# EAGLE design shield (EAGLE 9.0.1)
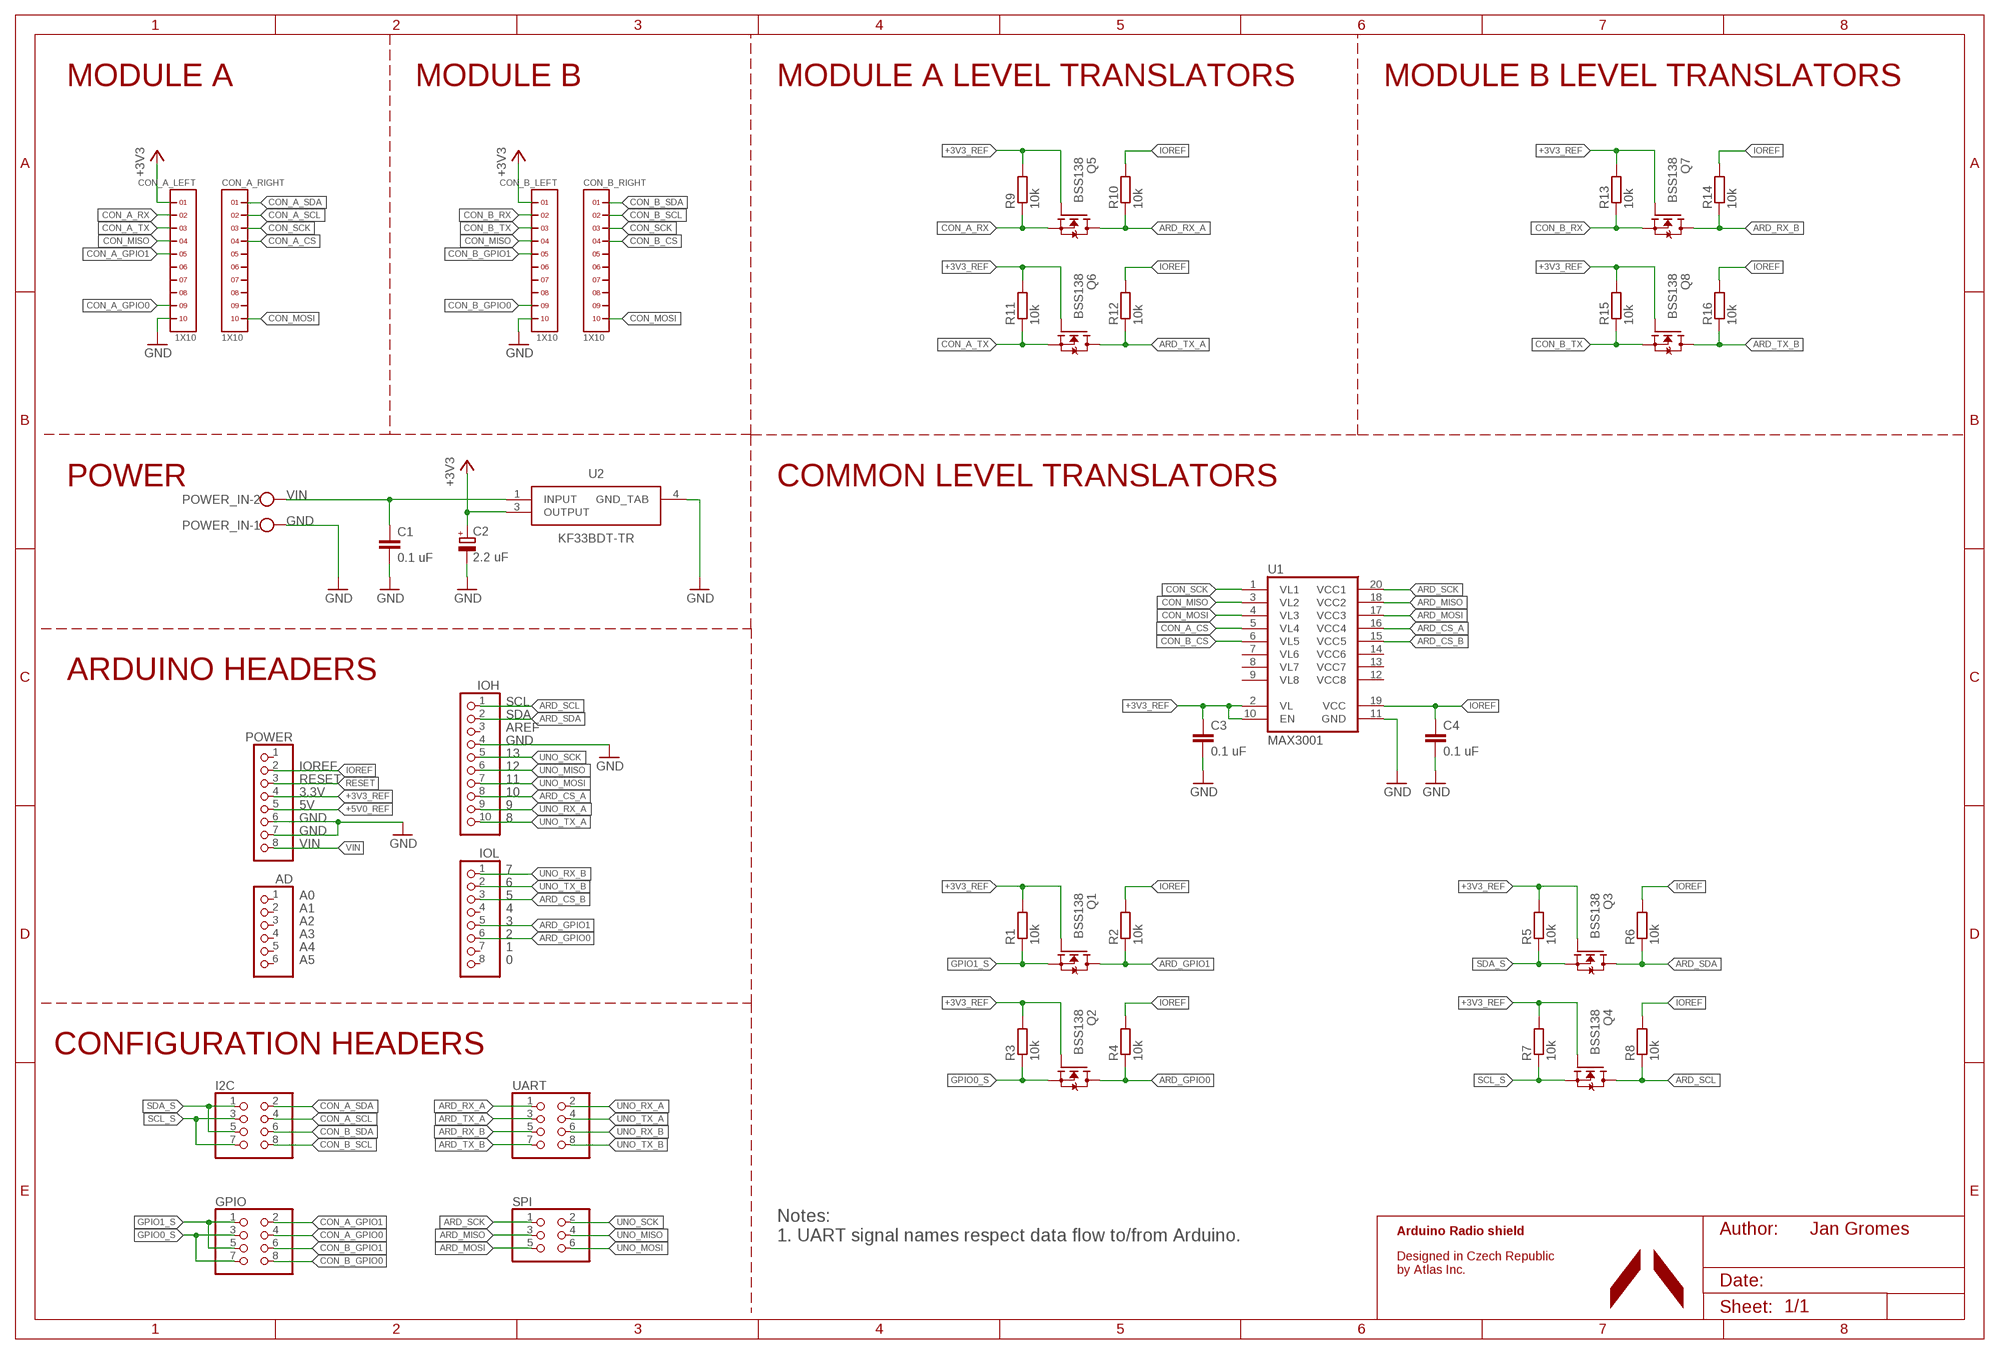
[diagram p0: schematic, sheet 1]

## Parts
AD  PINHD-1X6  [1X06]
C1  0.1 uF  C-EUC0603  [C0603]
C2  2.2 uF  CPOL-EUSMCA  [SMC_A]
C3  0.1 uF  C-EUC0603  [C0603]
C4  0.1 uF  C-EUC0603  [C0603]
CON_A_LEFT  1X10  [1X10]
CON_A_RIGHT  1X10  [1X10]
CON_B_LEFT  1X10  [1X10]
CON_B_RIGHT  1X10  [1X10]
GPIO  PINHD-2X4  [2X04]
I2C  PINHD-2X4  [2X04]
IOH  PINHD-1X10  [1X10]
IOL  PINHD-1X8  [1X08]
POWER  PINHD-1X8  [1X08]
POWER_IN  W237-102  [W237-102]
Q1  BSS138  [SOT23]
Q2  BSS138  [SOT23]
Q3  BSS138  [SOT23]
Q4  BSS138  [SOT23]
Q5  BSS138  [SOT23]
Q6  BSS138  [SOT23]
Q7  BSS138  [SOT23]
Q8  BSS138  [SOT23]
R1  10k  R-EU_R0603  [R0603]
R2  10k  R-EU_R0603  [R0603]
R3  10k  R-EU_R0603  [R0603]
R4  10k  R-EU_R0603  [R0603]
R5  10k  R-EU_R0603  [R0603]
R6  10k  R-EU_R0603  [R0603]
R7  10k  R-EU_R0603  [R0603]
R8  10k  R-EU_R0603  [R0603]
R9  10k  R-EU_R0603  [R0603]
R10  10k  R-EU_R0603  [R0603]
R11  10k  R-EU_R0603  [R0603]
R12  10k  R-EU_R0603  [R0603]
R13  10k  R-EU_R0603  [R0603]
R14  10k  R-EU_R0603  [R0603]
R15  10k  R-EU_R0603  [R0603]
R16  10k  R-EU_R0603  [R0603]
SPI  PINHD-2X3  [2X03]
U1  MAX3001  [TSSOP20]
U2  KF33BDT-TR  [TO228P972X240-3N]
UART  PINHD-2X4  [2X04]

## Nets
+3V3: C2.+ CON_A_LEFT.1 CON_B_LEFT.1 U2.3(OUTPUT)
+3V3_REF: C3.1 POWER.4 Q1.1(G) Q2.1(G) Q3.1(G) Q4.1(G) Q5.1(G) Q6.1(G) Q7.1(G) Q8.1(G) R1.2 R3.2 R5.2 R7.2 R9.2 R11.2 R13.2 R15.2 U1.2(VL) U1.10(EN)
+5V0_REF: POWER.5
ARD_CS_A: IOH.8 U1.16(VCC4)
ARD_CS_B: IOL.3 U1.15(VCC5)
ARD_GPIO0: IOL.6 Q2.3(D) R4.1
ARD_GPIO1: IOL.5 Q1.3(D) R2.1
ARD_MISO: SPI.3 U1.18(VCC2)
ARD_MOSI: SPI.5 U1.17(VCC3)
ARD_RX_A: Q5.3(D) R10.1 UART.1
ARD_RX_B: Q7.3(D) R14.1 UART.5
ARD_SCK: SPI.1 U1.20(VCC1)
ARD_SCL: IOH.1 Q4.3(D) R8.1
ARD_SDA: IOH.2 Q3.3(D) R6.1
ARD_TX_A: Q6.3(D) R12.1 UART.3
ARD_TX_B: Q8.3(D) R16.1 UART.7
CON_A_CS: CON_A_RIGHT.4 U1.5(VL4)
CON_A_GPIO0: CON_A_LEFT.9 GPIO.4
CON_A_GPIO1: CON_A_LEFT.5 GPIO.2
CON_A_RX: CON_A_LEFT.2 Q5.2(S) R9.1
CON_A_SCL: CON_A_RIGHT.2 I2C.4
CON_A_SDA: CON_A_RIGHT.1 I2C.2
CON_A_TX: CON_A_LEFT.3 Q6.2(S) R11.1
CON_B_CS: CON_B_RIGHT.4 U1.6(VL5)
CON_B_GPIO0: CON_B_LEFT.9 GPIO.8
CON_B_GPIO1: CON_B_LEFT.5 GPIO.6
CON_B_RX: CON_B_LEFT.2 Q7.2(S) R13.1
CON_B_SCL: CON_B_RIGHT.2 I2C.8
CON_B_SDA: CON_B_RIGHT.1 I2C.6
CON_B_TX: CON_B_LEFT.3 Q8.2(S) R15.1
CON_MISO: CON_A_LEFT.4 CON_B_LEFT.4 U1.3(VL2)
CON_MOSI: CON_A_RIGHT.10 CON_B_RIGHT.10 U1.4(VL3)
CON_SCK: CON_A_RIGHT.3 CON_B_RIGHT.3 U1.1(VL1)
GND: C1.2 C2.- C3.2 C4.2 CON_A_LEFT.10 CON_B_LEFT.10 IOH.4 POWER.6 POWER.7 POWER_IN.1 U1.11(GND) U2.4(GND_TAB)
GPIO0_S: GPIO.3 GPIO.7 Q2.2(S) R3.1
GPIO1_S: GPIO.1 GPIO.5 Q1.2(S) R1.1
IOREF: C4.1 POWER.2 R2.2 R4.2 R6.2 R8.2 R10.2 R12.2 R14.2 R16.2 U1.19(VCC)
RESET: POWER.3
SCL_S: I2C.3 I2C.7 Q4.2(S) R7.1
SDA_S: I2C.1 I2C.5 Q3.2(S) R5.1
UNO_MISO: IOH.6 SPI.4
UNO_MOSI: IOH.7 SPI.6
UNO_RX_A: IOH.9 UART.2
UNO_RX_B: IOL.1 UART.6
UNO_SCK: IOH.5 SPI.2
UNO_TX_A: IOH.10 UART.4
UNO_TX_B: IOL.2 UART.8
VIN: C1.1 POWER.8 POWER_IN.2 U2.1(INPUT)
Unconnected: AD.1 AD.2 AD.3 AD.4 AD.5 AD.6 CON_A_LEFT.6 CON_A_LEFT.7 CON_A_LEFT.8 CON_A_RIGHT.5 CON_A_RIGHT.6 CON_A_RIGHT.7 CON_A_RIGHT.8 CON_A_RIGHT.9 CON_B_LEFT.6 CON_B_LEFT.7 CON_B_LEFT.8 CON_B_RIGHT.5 CON_B_RIGHT.6 CON_B_RIGHT.7 CON_B_RIGHT.8 CON_B_RIGHT.9 IOH.3 IOL.4 IOL.7 IOL.8 POWER.1 U1.7(VL6) U1.8(VL7) U1.9(VL8) U1.12(VCC8) U1.13(VCC7) U1.14(VCC6)

## Notes on the sheet
- MODULE A | MODULE B | MODULE A LEVEL TRANSLATORS | MODULE B LEVEL TRANSLATORS
- POWER | COMMON LEVEL TRANSLATORS
- ARDUINO HEADERS
- SCL
- SDA
- AREF
- 13
- IOREF | 12
- RESET | 11
- 3.3V | 10
- 5V | 9
- GND | 8
- VIN
- 7
- 6
- A0 | 5
- A1 | 4
- A2 | 3
- A3 | 2
- A4 | 1
- A5 | 0
- CONFIGURATION HEADERS
- Notes:
  1. UART signal names respect data flow to/from Arduino.
- Arduino Radio shield | Jan Gromes
- Designed in Czech Republic
  by Atlas Inc.

## Library data of the parts
AD = pinhead:PINHD-1X6: PIN HEADER
C1 C3 C4 = rcl:C-EU: CAPACITOR, European symbol; SPICEPREFIX: C
C2 = rcl:CPOL-EU: POLARIZED CAPACITOR, European symbol; SPICEPREFIX: C
CON_A_LEFT CON_A_RIGHT CON_B_LEFT CON_B_RIGHT = headers(2mm):1X10
GPIO I2C UART = pinhead:PINHD-2X4: PIN HEADER
IOH = pinhead:PINHD-1X10: PIN HEADER
IOL POWER = pinhead:PINHD-1X8: PIN HEADER
POWER_IN = con-wago-500:W237-102: WAGO SCREW CLAMP; MPN: 237-102; OC_FARNELL: unknown; OC_NEWARK: 70K9898
Q1-Q8 = bss138_10:BSS138: BSS138 N-Channel Logic Level Enhancement Mode Field Effect Transistor Source: http://www.fairchildsemi.com/datasheets/BS/BSS138.pdf; MF: Fairchild; MPN: BSS138; OC_FARNELL: 9845330; OC_NEWARK: 67R2009
R1-R16 = rcl:R-EU_: RESISTOR, European symbol; SPICEPREFIX: R
SPI = pinhead:PINHD-2X3: PIN HEADER
U1 = maxim-11:MAX30*: +1.2V to +5.5V, ±15kV ESD-Protected, 0.1?A, 35Mbps, 8-Channel Level Translators
U2 = KF33BDT-TR:KF33BDT-TR: LDO Regulator, 3.3V, 0.5A, DPAK KF33BDT-TR, Low Dropout Voltage Regulator, 0.5A, 3.3 V 2%, 2.5 20 Vin, 3-Pin DPAK <https://componentsearchengine.com/Images/9/KF33BDT-TR.jpg> Source: Datasheet <http://www.st.com/web/en/resource/technical/document/datasheet/CD00000970.pdf>; ALLIED_NUMBER: 70389971; DESCRIPTION: LDO Regulator, 3.3V, 0.5A, DPAK KF33BDT-TR, Low Dropout Voltage Regulator, 0.5A, 3.3 V 2%, 2.5 20 Vin, 3-Pin DPAK; HEIGHT: 2.4mm; MANUFACTURER_NAME: STMicroelectronics; MANUFACTURER_PART_NUMBER: KF33BDT-TR; RS_PART_NUMBER: 7140616; SUPPLIER_NAME: RS

## Board
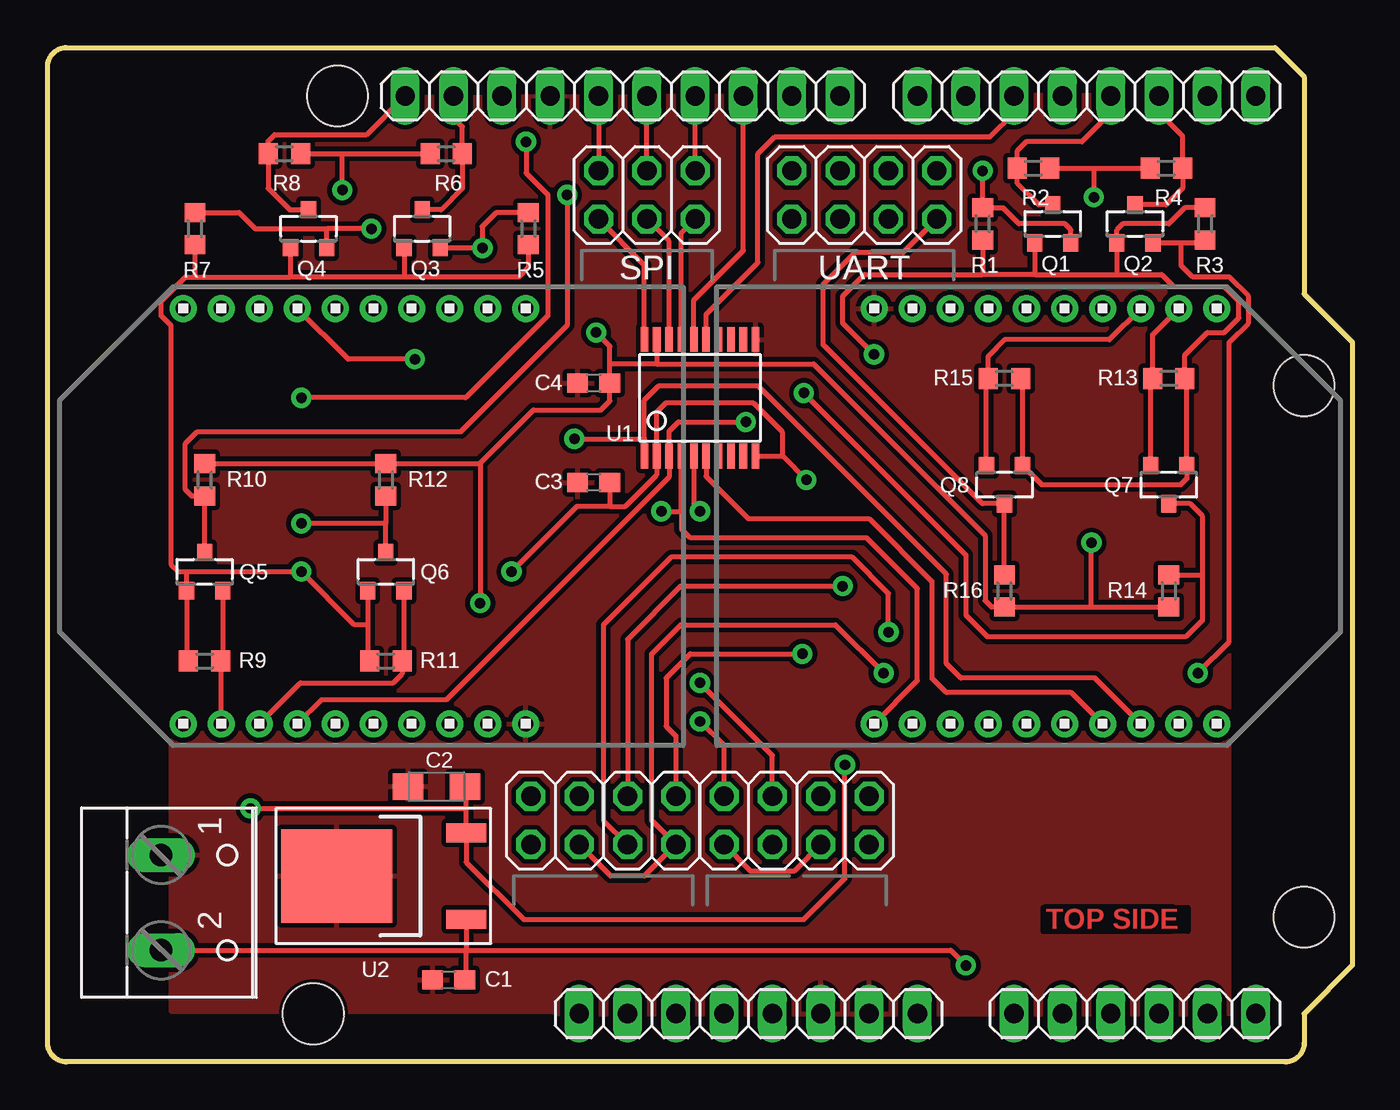
[diagram p1: board, top side]
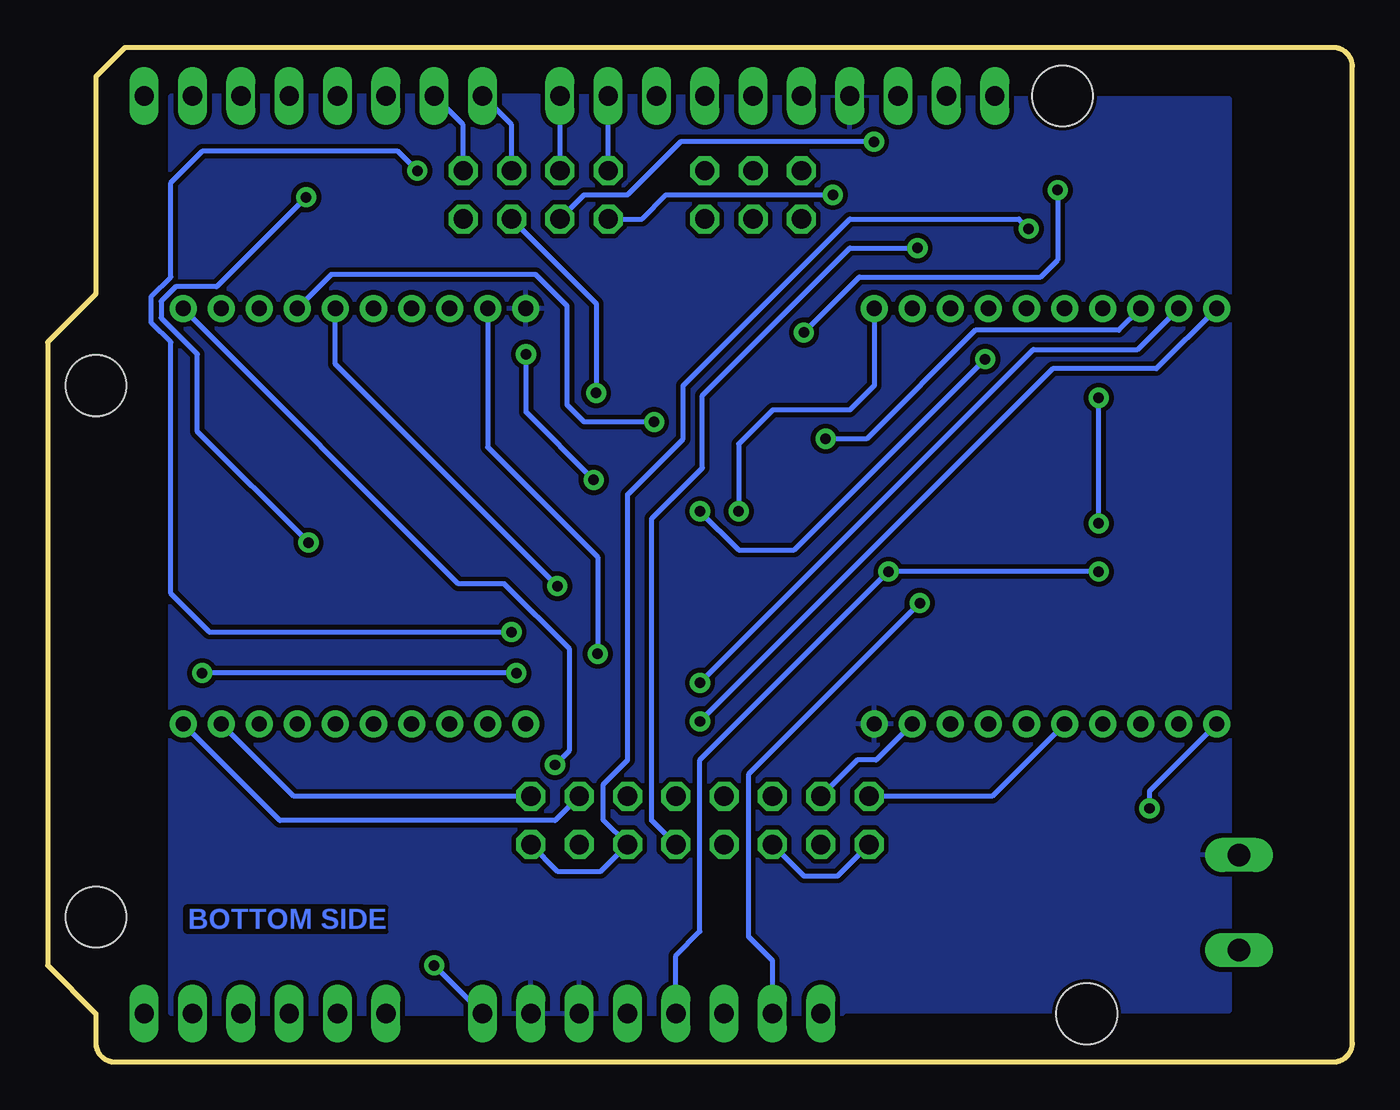
[diagram p2: board, bottom side, seen from below]

Size 68.58 x 53.34 mm. Coordinates in mm from the lower left corner, seen from the top.
Outline: 64.52,53.34 66.04,51.82 66.04,40.39 68.58,37.85 68.58,5.08 66.04,2.54 66.04,1 arc-90 65.04,0 1,0 arc-90 0,1 0,52.34 arc-90 1,53.34 64.52,53.34
Copper layers (1*16): Top 0.035mm / dielectric 1.5mm / Bottom 0.035mm
Design rules "SparkFun-2-layer-STANDARD": minimum track width 10mil, minimum drill 20mil, track to track 10mil, track to pad 8mil, pad to pad 8mil, via to via 10mil, smd to smd 8mil, copper to edge 8mil, drill to drill 8mil, minimum pad ring 10mil, minimum via ring 10mil, stop-mask expansion 4mil, vias tented up to drill 25mil, thermal gap 10mil
Holes 3.2 mm at 13.97,2.54 66.04,7.62 66.04,35.56 15.24,50.8

### Footprints (pad centres in the part's own frame; a part is rotated, then mirrored left to right if it is on the bottom)
1X06 = drill 1.016 long: 1 -6.35,0; 2 -3.81,0; 3 -1.27,0; 4 1.27,0; 5 3.81,0; 6 6.35,0
C0603 = smd 1.1 x 1: 1 -0.85,0; 2 0.85,0
SMC_A = smd 1.6 x 1.4: + -1.5,0; - 1.5,0
1X10 = drill 0.8 pad 1.422: 1 -9,0; 2 -7,0; 3 -5,0; 4 -3,0; 5 -1,0; 6 1,0; 7 3,0; 8 5,0; 9 7,0; 10 9,0
2X04 = drill 1.016 octagon: 1 -3.81,-1.27; 2 -3.81,1.27; 3 -1.27,-1.27; 4 -1.27,1.27; 5 1.27,-1.27; 6 1.27,1.27; 7 3.81,-1.27; 8 3.81,1.27
1X10' = drill 1.016 long: 1 -11.43,0; 2 -8.89,0; 3 -6.35,0; 4 -3.81,0; 5 -1.27,0; 6 1.27,0; 7 3.81,0; 8 6.35,0; 9 8.89,0; 10 11.43,0
1X08 = drill 1.016 long: 1 -8.89,0; 2 -6.35,0; 3 -3.81,0; 4 -1.27,0; 5 1.27,0; 6 3.81,0; 7 6.35,0; 8 8.89,0
W237-102 = drill 1.194 long: 1 -2.5,-1.27; 2 2.5,-1.27
SOT23 = smd 0.8 x 0.9: 1 -0.95,-1; 2 0.95,-1; 3 0,1
R0603 = smd 1 x 1.1: 1 -0.85,0; 2 0.85,0
2X03 = drill 1.016 octagon: 1 -2.54,-1.27; 2 -2.54,1.27; 3 0,-1.27; 4 0,1.27; 5 2.54,-1.27; 6 2.54,1.27
TSSOP20 = smd 0.4 x 1.3: 1 -2.925,-3.068; 2 -2.275,-3.068; 3 -1.625,-3.068; 4 -0.975,-3.068; 5 -0.325,-3.068; 6 0.325,-3.068; 7 0.975,-3.068; 8 1.625,-3.068; 9 2.275,-3.068; 10 2.925,-3.068; 11 2.925,3.068; 12 2.275,3.068; 13 1.625,3.068; 14 0.975,3.068; 15 0.325,3.068; 16 -0.325,3.068; 17 -0.975,3.068; 18 -1.625,3.068; 19 -2.275,3.068; 20 -2.925,3.068
TO228P972X240-3N = smd 2.1 x 1: 1 -4.35,2.28; 3 -4.35,-2.28 | smd 5.85 x 4.9: 4 2.45,0

### Placement (x,y rotation side)
AD  57.15,2.54 0 top
C1  21.08,4.32 180 top
C2  20.45,14.48 180 top
C3  28.7,30.48 180 top
C4  28.7,35.69 180 top
CON_A_LEFT  16.13,17.78 0 top
CON_A_RIGHT  16.13,39.62 0 top
CON_B_LEFT  52.45,39.62 180 top
CON_B_RIGHT  52.45,17.78 180 top
GPIO  29.21,12.7 0 top
I2C  39.37,12.7 0 top
IOH  [1X10']  30.23,50.8 0 top
IOL  54.61,50.8 0 top
POWER  36.83,2.54 0 top
POWER_IN  7.24,8.38 270 top
Q1  52.83,44.07 0 top
Q2  57.15,44.07 0 top
Q3  19.68,43.81 0 top
Q4  13.72,43.81 0 top
Q5  8.26,25.78 0 top
Q6  17.78,25.78 0 top
Q7  58.93,30.35 180 top
Q8  50.29,30.35 180 top
R1  49.15,44.07 270 top
R2  51.82,46.99 0 top
R3  60.83,44.07 90 top
R4  58.8,46.99 180 top
R5  25.27,43.81 270 top
R6  20.95,47.75 180 top
R7  7.75,43.81 270 top
R8  12.45,47.75 0 top
R9  8.26,21.08 180 top
R10  8.26,30.61 90 top
R11  17.78,21.08 180 top
R12  17.78,30.61 90 top
R13  58.93,35.94 0 top
R14  58.93,24.77 270 top
R15  50.29,35.94 0 top
R16  50.29,24.77 270 top
SPI  31.5,45.59 0 top
U1  34.29,34.92 0 top
U2  17.65,9.78 180 top
UART  42.93,45.59 0 top

### Tracks (layer width: path | path; a pad name or v marks a point on that pad's centre or on a via)
+3V3  (via drill 0.55)
  Top 0.254: 22,13.34 U2.3 22,10.51 25.02,7.49 39.75,7.49 41.91,9.65 v41.91,15.62 | C2.+ 22,14.42 22,13.34 | v10.67,13.34 22,13.34
  Bottom 0.254: 7.13,17.76 CON_A_LEFT.1 10.67,14.24 v10.67,13.34 | CON_B_LEFT.1 61.45,39.61 46.99,25.15 44.58,25.15 41.15,21.72 41.15,16.38 v41.91,15.62
+3V3_REF  (via drill 0.55)
  Top 0.254: 51.88,41.4 49.15,41.4 | 7.3,25.78 6.86,25.78 6.48,26.16 6.48,38.73 5.97,39.24 5.97,40.01 7.24,41.27 7.75,41.27 | 7.3,25.78 v13.34,25.78 | 7.3,25.78 Q5.1 7.3,21.08 R9.2 | Q6.1 16.83,22.99 | 16.83,22.99 16.83,21.08 R11.2 | U1.10 38.61,31.86 | 38.61,31.86 38.61,33.15 37.08,34.67 32.51,34.67 32.02,34.17 U1.2 32.02,30.87 30.35,29.21 29.55,29.21 | R13.2 59.88,35.94 Q7.1 59.88,30.67 59.56,30.35 52.24,30.35 Q8.1 51.24,35.94 R15.2 | 49.15,41.4 42.93,41.4 41.78,40.26 41.78,38.86 v43.43,37.21 | R7.2 7.75,41.27 | 7.75,41.27 12.77,41.27 | Q4.1 12.77,41.27 | R1.2 49.15,41.4 | Q1.1 51.88,41.4 | R3.2 59.78,44.92 58.93,44.07 56.52,44.07 56.2,43.75 Q2.1 56.2,41.4 | C3.1 29.55,29.21 | 38.61,31.86 38.63,31.86 v39.88,30.61 | 29.55,29.21 27.81,29.21 v24.38,25.78 | 51.88,41.4 56.2,41.4 | 56.2,41.4 58.55,41.4 59.18,40.77 61.85,40.77 62.61,40.01 62.61,39.12 61.85,38.35 60.96,38.35 59.78,37.17 R13.2 | R13.2 59.78,36.28 | R5.2 25.27,41.78 24.77,41.27 18.73,41.27 | 18.73,41.27 12.77,41.27 | Q3.1 18.73,41.27 | 13.59,25.78 v13.34,25.78 | 16.83,22.99 16.13,22.99 v13.34,25.78
  Bottom 0.254: POWER.4 35.56,5.59 34.29,6.86 34.29,15.88 v24.38,25.78 v13.34,25.78 | v39.88,30.61 43.43,34.16 v43.43,37.21
ARD_CS_A
  Top 0.254: U1.16 33.97,40.06 36.58,42.67 IOH.8
ARD_CS_B
  Top 0.254: IOL.3 50.8,49.91 49.53,48.64 38.23,48.64 37.34,47.75 37.34,42.04 34.62,39.31 U1.15
ARD_GPIO0
  Top 0.254: IOL.6 58.42,49.91 59.65,48.68 R4.1 59.65,45.94 58.78,45.07 Q2.3
ARD_GPIO1
  Top 0.254: 52.89,45.07 Q1.3 52.09,45.07 50.97,46.19 R2.1 50.97,47.92 51.44,48.39 54.36,48.39 55.88,49.91 IOL.5
ARD_MISO
  Top 0.254: U1.18 32.66,43.15 SPI.3
ARD_MOSI
  Top 0.254: U1.17 33.31,43.6 SPI.5
ARD_RX_A  (via drill 0.55)
  Top 0.254: Q5.3 R10.1 7.58,29.76 7.24,30.1 7.24,32.51 7.87,33.15 21.72,33.15 27.3,38.73 v27.3,45.59
  Bottom 0.254: v27.3,45.59 36.07,45.59 37.34,44.32 UART.1
ARD_RX_B  (via drill 0.55)
  Top 0.254: 60.71,25.61 60.71,23.24 59.82,22.35 49.4,22.35 48.26,23.5 48.26,26.67 v39.75,35.18 | 60.71,25.61 60.71,28.7 60.05,29.35 Q7.3 | R14.1 60.71,25.61
  Bottom 0.254: UART.5 39.75,39.88 v39.75,35.18
ARD_SCK
  Top 0.254: U1.20 31.37,41.91 SPI.1
ARD_SCL
  Top 0.254: IOH.1 16.76,48.77 11.94,48.77 11.6,48.43 R8.1 11.6,45.94 12.72,44.81 Q4.3
ARD_SDA
  Top 0.254: R6.1 21.8,49.19 21.34,49.66 IOH.2 | 21.84,47.71 R6.1 | Q3.3 20.68,44.81 21.8,45.94 R6.1
ARD_TX_A  (via drill 0.55)
  Top 0.254: 17.78,28.32 v13.34,28.32 | R12.1 17.78,28.32 | Q6.3 17.78,28.32 | v13.34,34.92 21.97,34.92 26.29,39.24 26.29,45.59 25.15,46.74 v25.15,48.39
  Bottom 0.254: UART.3 40.39,45.59 38.1,45.59 35.31,48.39 v25.15,48.39 | v13.34,28.32 v13.34,34.92
ARD_TX_B
  Top 0.254: R16.1 Q8.3 49.13,29.35 40.77,37.72 40.77,40.89 42.42,42.55 44.96,42.55 UART.7
CON_A_CS  (via drill 0.55)
  Top 0.254: U1.5 33.97,29.28 v34.29,28.96 | CON_A_RIGHT.4 15.8,36.96 v19.3,36.96
  Bottom 0.254: v34.29,28.96 32.26,26.92 29.34,26.92 v19.3,36.96
CON_A_GPIO0
  Bottom 0.254: CON_A_LEFT.9 25.03,15.88 26.04,15.88 GPIO.4
CON_A_GPIO1
  Bottom 0.254: CON_A_LEFT.5 18.94,13.97 GPIO.2
CON_A_RX
  Top 0.254: CON_A_LEFT.2 9.13,21.08 | 9.13,21.08 R9.1 | Q5.2 9.21,21.08 9.13,21.08
CON_A_SCL  (via drill 0.55)
  Top 0.254: I2C.4 38.1,16.13 v34.29,19.94
  Bottom 0.254: CON_A_RIGHT.2 11.29,37.47 16.76,37.47 v34.29,19.94
CON_A_SDA  (via drill 0.55)
  Top 0.254: I2C.2 35.56,16.64 v34.29,17.91
  Bottom 0.254: CON_A_RIGHT.1 10.3,36.45 15.75,36.45 v34.29,17.91
CON_A_TX
  Top 0.254: Q6.2 18.73,21.08 R11.1 18.63,20.41 18.16,19.94 13.29,19.94 CON_A_LEFT.3
CON_B_CS
  Top 0.254: U1.6 34.62,30.79 36.83,28.57 43.18,28.57 46.48,25.27 46.48,20.19 47.24,19.43 53.8,19.43 CON_B_RIGHT.4
CON_B_GPIO0  (via drill 0.55)
  Top 0.254: v39.67,21.46 33.78,21.46 32.51,20.19 32.51,17.65 33.02,17.14 GPIO.8
  Bottom 0.254: v39.67,21.46 39.67,26.54 45.45,32.32 CON_B_LEFT.9
CON_B_GPIO1  (via drill 0.55)
  Top 0.254: v41.78,25.02 33.27,25.02 30.48,22.23 GPIO.6
  Bottom 0.254: v41.78,25.02 53.45,36.69 CON_B_LEFT.5
CON_B_RX
  Top 0.254: CON_B_LEFT.2 58.08,38.25 R13.1 57.98,35.94 Q7.2
CON_B_SCL
  Bottom 0.254: I2C.8 55.64,13.97 CON_B_RIGHT.2
CON_B_SDA
  Bottom 0.254: I2C.6 41.91,12.7 56.37,12.7 CON_B_RIGHT.1
CON_B_TX
  Top 0.254: Q8.2 49.34,35.94 R15.1 49.44,37.12 50.29,37.97 55.8,37.97 CON_B_LEFT.3
CON_MISO  (via drill 0.55)
  Top 0.254: v36.7,33.66 33.15,33.66 32.66,33.17 U1.3 32.66,30.76 20.95,19.05 14.4,19.05 CON_A_LEFT.4
  Bottom 0.254: v36.7,33.66 40.39,33.66 41.27,34.54 41.27,39.75 42.93,41.4 53.67,41.4 CON_B_LEFT.4
CON_MOSI  (via drill 0.55)
  Top 0.254: 33.31,28.96 33.31,28.03 33.78,27.56 43.05,27.56 45.72,24.89 45.72,20.05 CON_B_RIGHT.10 | 33.31,28.96 U1.4 | v32.26,28.96 33.31,28.96
  Bottom 0.254: v32.26,28.96 32.26,32.49 30.46,34.29 26.42,34.29 25.13,35.58 CON_A_RIGHT.10
CON_SCK  (via drill 0.55)
  Top 0.254: CON_B_RIGHT.3 55.04,20.19 48.01,20.19 47.24,20.95 47.24,25.65 37.34,35.56 32.13,35.56 31.36,34.79 31.36,32.77 | U1.1 31.36,32.77 | v27.69,32.77 31.36,32.77
  Bottom 0.254: CON_A_RIGHT.3 12.27,38.48 19.81,38.48 25.53,32.77 v27.69,32.77
GND
  pour Top: 6.48,2.67 26.8,2.67 26.8,2.54 62.1,2.54 62.1,50.8 42.8,50.8 12.45,50.67 6.48,50.67
  pour Bottom: 6.48,2.67 26.8,2.67 26.8,2.54 62.1,2.54 62.1,50.8 42.8,50.8 12.45,50.67 6.48,50.67
GPIO0_S  (via drill 0.55)
  Top 0.254: v43.94,20.45 41.4,22.99 33.27,22.99 31.75,21.46 31.75,12.7 GPIO.7 31.37,9.78 29.59,9.78 GPIO.3 | v60.45,20.45 62.1,22.1 62.1,37.85 63.12,38.86 63.12,40.26 62.1,41.27 60.2,41.27 59.56,41.91 59.56,43.07 | Q2.2 59.56,43.07 | 59.56,43.07 60.68,43.07 60.81,43.2 | 60.81,43.2 R3.1 | 60.83,43.18 60.81,43.2
  Bottom 0.254: v43.94,20.45 v60.45,20.45
GPIO1_S  (via drill 0.55)
  Top 0.254: v49.15,46.86 R1.1 50.2,44.92 51.05,44.07 53.47,44.07 53.78,43.75 Q1.2 | v44.2,22.61 44.2,24.64 42.29,26.54 32.77,26.54 29.21,22.99 29.21,12.7 GPIO.5
  Bottom 0.254: v44.2,22.61 60.07,22.61 62.1,24.64 62.1,37.85 63.12,38.86 63.12,40.26 62.1,41.27 62.1,46.23 60.45,47.88 50.16,47.88 v49.15,46.86 | GPIO.1 27.05,9.78 28.83,9.78 GPIO.5
IOREF  (via drill 0.55)
  Top 0.254: 54.99,46.99 R4.2 | 54.99,46.99 v54.99,45.47 | R10.2 R12.2 22.69,31.46 22.73,31.5 | 54.86,23.91 R16.2 49.62,23.91 49.28,24.26 49.28,27.69 40.26,36.7 32,36.7 | 54.86,23.91 R14.2 | 54.86,23.91 v54.86,27.3 | v15.49,45.85 15.49,47.75 | 15.49,47.75 R6.2 | R8.2 15.49,47.75 | R2.2 54.99,46.99 | 29.55,36.7 C4.1 29.55,34.76 29.08,34.29 25.53,34.29 22.73,31.5 | 29.55,36.7 29.55,37.63 v28.83,38.35 | U1.19 32.02,36.71 32,36.7 | 32,36.7 29.55,36.7 | 22.73,31.5 v22.73,24.13
  Bottom 0.254: v54.99,45.47 59.69,40.77 61.85,40.77 62.61,40.01 62.61,39.12 60.71,37.21 60.71,33.15 v54.86,27.3 | POWER.2 30.48,5.33 31.75,6.6 31.75,15.11 v22.73,24.13 | v15.49,45.85 15.49,42.16 16.38,41.27 25.91,41.27 v28.83,38.35
N$8
  cutout Bottom: 50.8,8.13 61.21,8.13 61.21,6.86 50.8,6.86
N$9
  cutout Top: 52.32,8.13 59.94,8.13 59.94,6.86 52.32,6.86
SCL_S  (via drill 0.55)
  Top 0.254: v17.02,43.81 14.67,43.81 | Q4.2 14.67,43.81 | 14.67,43.81 10.92,43.81 10.07,44.66 R7.1
  Bottom 0.254: I2C.7 41.78,10.03 39.5,10.03 I2C.3 39.37,12.7 39.37,14.61 38.1,15.88 38.1,29.84 35.18,32.77 35.18,35.56 26.42,44.32 17.53,44.32 v17.02,43.81
SDA_S  (via drill 0.55)
  Top 0.254: I2C.1 36.96,10.03 39.24,10.03 I2C.5 | R5.1 23.58,44.66 22.84,43.93 22.84,42.81 | Q3.2 22.84,42.81 | 22.84,42.81 v22.86,42.8
  Bottom 0.254: v22.86,42.8 26.42,42.8 34.16,35.05 34.16,31.24 36.83,28.57 36.83,12.7 I2C.1
UNO_MISO
  Top 0.254: SPI.4 IOH.6
UNO_MOSI
  Top 0.254: SPI.6 IOH.7
UNO_RX_A
  Bottom 0.254: UART.2 IOH.9
UNO_RX_B
  Bottom 0.254: UART.6 44.2,49.28 IOL.1
UNO_SCK
  Top 0.254: IOH.5 SPI.2
UNO_TX_A
  Bottom 0.254: IOH.10 UART.4
UNO_TX_B
  Bottom 0.254: UART.8 46.74,49.28 IOL.2
VIN  (via drill 0.55)
  Top 0.254: POWER_IN.2 21.97,5.88 | U2.1 22,5.91 21.97,5.88 | 21.97,5.88 21.97,4.36 C1.1 | v48.26,5.08 47.46,5.88 21.97,5.88
  Bottom 0.254: 6.14,5.71 POWER_IN.2 | v48.26,5.08 POWER.8

### Text on the board
Top: TOP SIDE
Bottom: BOTTOM SIDE
tDocu: SCL | AREF | GND | 3 | 2 | 1 | 10 | 9 | 8 | 7 | 6 | 5 | 4 | 3 | 2 | 1 | 0 | A | B | MODULE A | MODULE B | + | 0 | 1 | 0 | 1 | GND | Radio Shield | A | B | A | B | Rev. C | 3.3V | 5V | GND | GND | VIN | A0 | A1 | A2 | A3 | A4 | A5 | VIN
_tNames: R8 | R6 | R2 | R4 | R7 | Q4 | Q3 | R5 | SPI | UART | R1 | Q1 | Q2 | R3 | R15 | R13 | C4 | U1 | R10 | R12 | C3 | Q8 | Q7 | Q5 | Q6 | R16 | R14 | R9 | R11 | C2 | U2 | C1
_tDocu: GPIO | I2C